# Altium schematic sheet 780-00055, rev1, Pg5, SCH, NRES Temp Meas, 8-Chan RTD .SchDoc
size B; PageSetup: Record=PageOptions|CenterHorizontal=True|CenterVertical=True|PrintScale=1.09|XCorrection=1.00|YCorrection=1.00|PrintKind=0|BorderSize=5000000|LeftOffset=0|BottomOffset=0|Orientation=2|PaperLength=1000|PaperWidth=1000|Scale=100|PaperSource=7|PrintQuality=-4|MediaType=1|DitherType=10|PaperKind=Ledger|PrintScaleMode=1
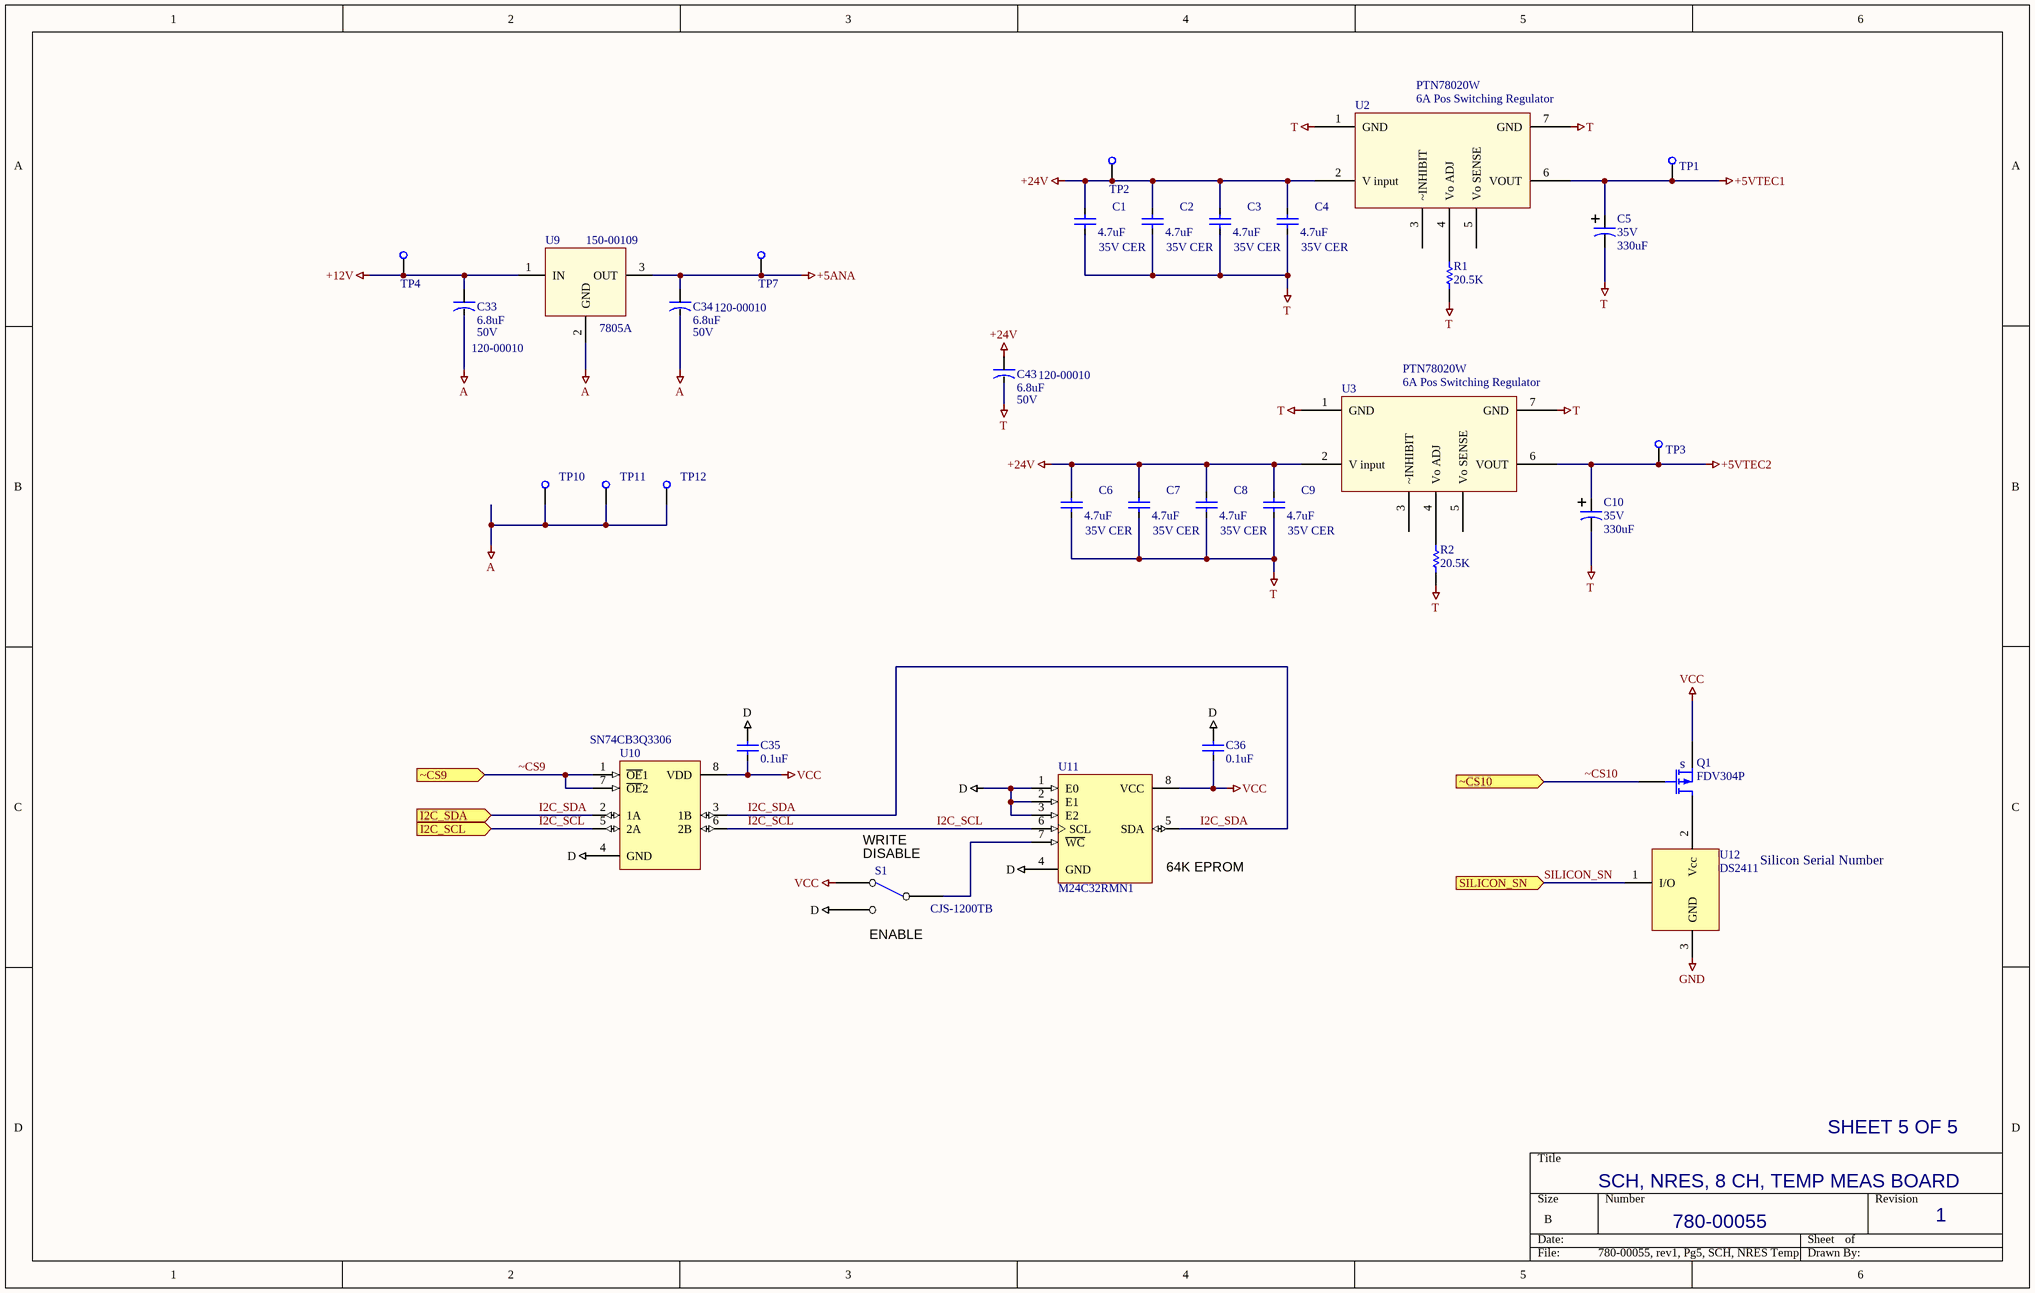
[diagram p0: 780-00055, rev1, Pg5, SCH, NRES Temp Meas, 8-Chan RTD .SchDoc]

## Parts
C1  35V CER  value 4.7uF  [SMD_0805]
C2  35V CER  value 4.7uF  [SMD_0805]
C3  35V CER  value 4.7uF  [SMD_0805]
C4  35V CER  value 4.7uF  [SMD_0805]
C5  35V  value 330uF  [CAP, Thru Hole 10mm dia]
C6  35V CER  value 4.7uF  [SMD_0805]
C7  35V CER  value 4.7uF  [SMD_0805]
C8  35V CER  value 4.7uF  [SMD_0805]
C9  35V CER  value 4.7uF  [SMD_0805]
C10  35V  value 330uF  [CAP, Thru Hole 10mm dia]
C33  50V  value 6.8uF  LCO P/N: 120-00010  [SMD_CAP_6032]
C34  50V  value 6.8uF  LCO P/N: 120-00010  [SMD_CAP_6032]
C35  value 0.1uF  [SMD_0805]  (hidden comment: Cap SMD)
C36  value 0.1uF  [SMD_0805]  (hidden comment: Cap SMD)
C43  50V  value 6.8uF  LCO P/N: 120-00010  [SMD_CAP_6032]
Q1  FDV304P  [SMD_SOT23_3]
R1  value 20.5K  [SMD_0805]  (hidden comment: Res 0805)
R2  value 20.5K  [SMD_0805]  (hidden comment: Res 0805)
S1  CJS-1200TB  [CAS-120B]
TP1  Test point  [PAD_80D_052H]  (value not drawn)
TP2  Test point  [PAD_80D_052H]  (value not drawn)
TP3  Test point  [PAD_80D_052H]  (value not drawn)
TP4  Test point  [PAD_80D_052H]  (value not drawn)
TP7  Test point  [PAD_80D_052H]  (value not drawn)
TP10  Test point  [PAD_80D_052H]  (value not drawn)
TP11  Test point  [PAD_80D_052H]  (value not drawn)
TP12  Test point  [PAD_80D_052H]  (value not drawn)
U2  6A Pos Switching Regulator  value PTN78020W  [TEXAS Inst Switching Regulator]
U3  6A Pos Switching Regulator  value PTN78020W  [TEXAS Inst Switching Regulator]
U9  value 7805A  LCO p/n: 150-00109  [TO-220 w/Heatsink 7136DG]  (hidden comment: Voltage Reg, Pos Fixed)
U10  value SN74CB3Q3306  [PW008_N]  (hidden comment: SN74CBT3306PWLE)
U11  M24C32RMN1  [SOP8_N]
U12  DS2411  [SMD_SOT23_3]

## Ports
I2C_SCL (in), I2C_SDA (in), SILICON_SN (in), ~CS9 (in), ~CS10 (in)

## Nets
+5ANA: C34.pos TP7.1(TP) U9.3(OUT)
+5VTEC1: C5.1 TP1.1(TP) U2.6(VOUT)
+5VTEC2: C10.1 TP3.1(TP) U3.6(VOUT)
+12V: C33.pos TP4.1(TP) U9.1(IN)
+24V: C1.2 C2.2 C3.2 C4.2 C6.2 C7.2 C8.2 C9.2 C43.pos TP2.1(TP) U2.2(V_input) U3.2(V_input)
A: C33.neg C34.neg TP10.1(TP) TP11.1(TP) TP12.1(TP) U9.2(GND)
D: C35.2 C36.2 S1.1(NO) U10.4(GND) U11.1(E0) U11.2(E1) U11.3(E2) U11.4(GND)
GND: U12.3(GND)
T: C1.1 C2.1 C3.1 C4.1 C5.2 C6.1 C7.1 C8.1 C9.1 C10.2 C43.neg R1.1 R2.1 U2.1(GND) U2.7(GND) U3.1(GND) U3.7(GND)
VCC: C35.1 C36.1 Q1.2(S) S1.3(NC) U10.8(VDD) U11.8(VCC)
I2C_SCL: U10.5(2A) U10.6(2B) U11.6(SCL) ; port I2C_SCL
I2C_SDA: U10.2(1A) U10.3(1B) U11.5(SDA) ; port I2C_SDA
SILICON_SN: U12.1(I/O) ; port SILICON_SN
~CS9: U10.1(~{OE}1) U10.7(~{OE}2) ; port ~CS9
~CS10: Q1.1(G) ; port ~CS10
NetQ1_3: Q1.3(D) U12.2(Vcc)
NetR1_2: R1.2 U2.4(Vo_ADJ)
NetR2_2: R2.2 U3.4(Vo_ADJ)
NetS1_2: S1.2(COM) U11.7(~{WC})

Not connected (* = marked no-connect by the designer): U2 3(~INHIBIT) 5(Vo_SENSE); U3 3(~INHIBIT) 5(Vo_SENSE)

## Notes on the sheet
- (near S1) WRITE
- (near S1) DISABLE
- (near U11) 64K EPROM
- Silicon Serial Number
- (near S1) ENABLE
- SHEET 5 OF 5
- SCH, NRES, 8 CH, TEMP MEAS BOARD
- 780-00055
- 1
- (in symbol FDV304P) s

## Library data of the parts
C1-C4 C6-C9 = Cap SMD: Capacitor; LCO p/n: 120-00051
C5 C10 = Cap Elec, 330 uF, 35V: Radial Thru hole; LCO p/n: 120-00053
C33 C34 C43 = Cap Tant 35V: outline 6.0mm x 3.2mm; Manufacturer: AVX; Manuf p/n: TAJC685K050RNJ; Vendor: DigiKey; Vendor p/n: 478-4776-1-ND; Vendor Mult.: 1; COST: 1.55
C35 C36 = Cap SMD: Capacitor; Manufacturer: AVX; Manuf p/n: 08055C104KAT2A; Vendor: DigiKey; Vendor p/n: 478-1395-1-ND; Vendor Mult.: 10; LCO P/N: 120-00002; COST: 0.088
Q1 = FDV304P: P-MOSFET LOGIC LEVEL; Manufacturer: Fairchild; Vendor: DigiKey; Vendor p/n: FDV304PCT-ND; Vendor Mult.: 1; LCO P/N: 195-00004; COST: 0.46; Manuf p/n: FDV304P; Value: FDV304P
R1 R2 = Res SMD: Resistor 0805; Manufacturer: Vishay/Dale; Manuf p/n: CRCW080520.5KFKEA; Vendor: DIGIKEY; Vendor p/n: 541-20.5KCCT-ND; Vendor Mult.: 10; LCO p/n: 181-02052; COST: 0.09
S1 = SW_SPDT_DOUG: Manufacturer: Copal Electronics; Manuf p/n: CAS-120TB; Vendor: DIGIKEY; Vendor Mult.: 1; LCO p/n: 185-00010; COST: 1.27; Value: SW_SPDT
TP1-TP4 TP7 TP10-TP12 = Test point: Manufacturer: Keystone; Manuf p/n: 1249; Vendor: Bisco Ind.; LCO p/n: 125-00013; Vendor p/n: 1249; COST: 0.18; VALUE: Test point
U2 U3 = PTN78020W: Pos Adj Switching Regulator; LCO p/n: 150-00088
U9 = Voltage Reg, Pos Fixed: 7805A; Manufacturer: On Semi; Vendor: Digi-Key; Vendor Mult.: 1; COST: 0.61
U10 = SN74CBT3306PWLE: Dual FET Bus Switch; Manufacturer: TI; Manuf p/n: SN74CB3Q3306APWR; LCO p/n: 150-00083; Vendor: Digi-Key; Vendor Mult.: 1; Vendor p/n: 296-15102-1-ND; COST: 0.95
U11 = M24C32RMN1: 32 Kbit Serial I²C Bus EEPROM; LCO p/n: 150-00076
U12 = DS2411: Silicon Serial Number; Manufacturer: MAXIM; Manuf p/n: DS2411R+T&R; Vendor: DIGIKEY; Vendor p/n: DS2411R+CT-ND; Vendor Mult.: 1; LCO p/n: 150-00031; COST: 1.25; VALUE: DS2411